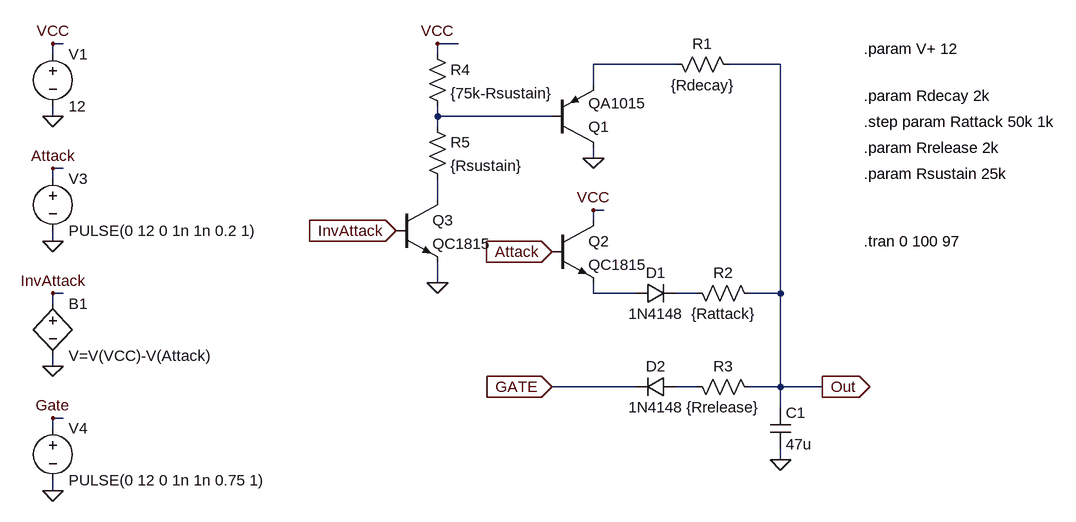
[diagram p0: schematic EG_Analog2_0_analog_attack.asc]
EG_Analog2_0_analog_attack.asc, the LTspice schematic file:
Version 4
SHEET 1 1508 724
WIRE -288 -176 -304 -176
WIRE 320 -176 288 -176
WIRE -304 -160 -304 -176
WIRE 288 -160 288 -176
WIRE 656 -144 528 -144
WIRE 816 -144 736 -144
WIRE 528 -112 528 -144
WIRE -304 -64 -304 -80
WIRE 288 -64 288 -80
WIRE 464 -64 288 -64
WIRE 288 -48 288 -64
WIRE 528 0 528 -16
WIRE -288 16 -304 16
WIRE -304 32 -304 16
WIRE 288 64 288 32
WIRE 544 80 528 80
WIRE 528 96 528 80
WIRE -304 128 -304 112
WIRE 288 192 288 160
WIRE -288 208 -304 208
WIRE 528 208 528 192
WIRE 592 208 528 208
WIRE 688 208 656 208
WIRE 816 208 816 -144
WIRE 816 208 768 208
WIRE -304 224 -304 208
WIRE -304 320 -304 304
WIRE 592 352 464 352
WIRE 688 352 656 352
WIRE 816 352 816 208
WIRE 816 352 768 352
WIRE 880 352 816 352
WIRE 816 384 816 352
WIRE -288 400 -304 400
WIRE -304 416 -304 400
WIRE 816 464 816 448
WIRE -304 512 -304 496
FLAG 224 112 InvAttack
IOPIN 224 112 In
FLAG 528 0 0
FLAG 464 144 Attack
IOPIN 464 144 In
FLAG 464 352 GATE
IOPIN 464 352 In
FLAG 816 464 0
FLAG 528 80 VCC
FLAG 880 352 Out
IOPIN 880 352 Out
FLAG -304 -64 0
FLAG -304 320 0
FLAG -304 -176 VCC
FLAG -304 208 InvAttack
FLAG -304 16 Attack
FLAG -304 128 0
FLAG -304 512 0
FLAG -304 400 Gate
FLAG 288 -176 VCC
FLAG 288 192 0
SYMBOL pnp 464 -16 M180
SYMATTR InstName Q1
SYMATTR Value QA1015
SYMBOL res 640 -160 M90
WINDOW 0 0 56 VBottom 2
WINDOW 3 32 56 VTop 2
SYMATTR InstName R1
SYMATTR Value {Rdecay}
SYMBOL npn 464 96 R0
SYMATTR InstName Q2
SYMATTR Value QC1815
SYMBOL diode 592 224 R270
WINDOW 0 32 32 VTop 2
WINDOW 3 0 32 VBottom 2
SYMATTR InstName D1
SYMATTR Value 1N4148
SYMBOL res 672 192 M90
WINDOW 0 0 56 VBottom 2
WINDOW 3 32 56 VTop 2
SYMATTR InstName R2
SYMATTR Value {Rattack}
SYMBOL diode 656 336 R90
WINDOW 0 0 32 VBottom 2
WINDOW 3 32 32 VTop 2
SYMATTR InstName D2
SYMATTR Value 1N4148
SYMBOL res 672 336 M90
WINDOW 0 0 56 VBottom 2
WINDOW 3 32 56 VTop 2
SYMATTR InstName R3
SYMATTR Value {Rrelease}
SYMBOL cap 800 384 R0
SYMATTR InstName C1
SYMATTR Value 47u
SYMBOL voltage -304 -176 R0
WINDOW 123 0 0 Left 2
WINDOW 39 0 0 Left 2
SYMATTR InstName V1
SYMATTR Value 12
SYMBOL voltage -304 16 R0
WINDOW 123 0 0 Left 2
WINDOW 39 0 0 Left 2
SYMATTR InstName V3
SYMATTR Value PULSE(0 12 0 1n 1n 0.2 1)
SYMBOL voltage -304 400 R0
WINDOW 123 0 0 Left 2
WINDOW 39 0 0 Left 2
SYMATTR InstName V4
SYMATTR Value PULSE(0 12 0 1n 1n 0.75 1)
SYMBOL res 272 -176 R0
SYMATTR InstName R4
SYMATTR Value {75k-Rsustain}
SYMBOL res 272 -64 R0
SYMATTR InstName R5
SYMATTR Value {Rsustain}
SYMBOL bv -304 208 R0
SYMATTR InstName B1
SYMATTR Value V=V(VCC)-V(Attack)
SYMBOL npn 224 64 R0
SYMATTR InstName Q3
SYMATTR Value QC1815
TEXT 944 -96 Left 2 !.param Rdecay 2k
TEXT 944 -56 Left 2 !.step param Rattack 50k 1k
TEXT 944 -16 Left 2 !.param Rrelease 2k
TEXT 944 128 Left 2 !.tran 0 100 97
TEXT 944 24 Left 2 !.param Rsustain 25k
TEXT 944 -168 Left 2 !.param V+ 12

The netlist it stands for:
* EG_Analog2_0_analog_attack.asc
Q1 0 N002 N001 0 QA1015
R1 N001 Out {Rdecay}
Q2 VCC Attack N004 0 QC1815
D1 N004 N005 1N4148
R2 N005 Out {Rattack}
D2 N006 GATE 1N4148
R3 N006 Out {Rrelease}
C1 Out 0 47u
V1 VCC 0 12
V3 Attack 0 PULSE(0 12 0 1n 1n 0.2 1)
V4 GATE 0 PULSE(0 12 0 1n 1n 0.75 1)
R4 VCC N002 {75k-Rsustain}
R5 N002 N003 {Rsustain}
B1 InvAttack 0 V=V(VCC)-V(Attack)
Q3 N003 InvAttack 0 0 QC1815
.model D D
.lib standard.dio
.model NPN NPN
.model PNP PNP
.lib standard.bjt
.param Rdecay 2k
.step param Rattack 50k 1k
.param Rrelease 2k
.tran 0 100 97
.param Rsustain 25k
.param V+ 12
.backanno
.end